# EAGLE design 7segement3digits1badidea-mk-1.0 (EAGLE 6.5.0)
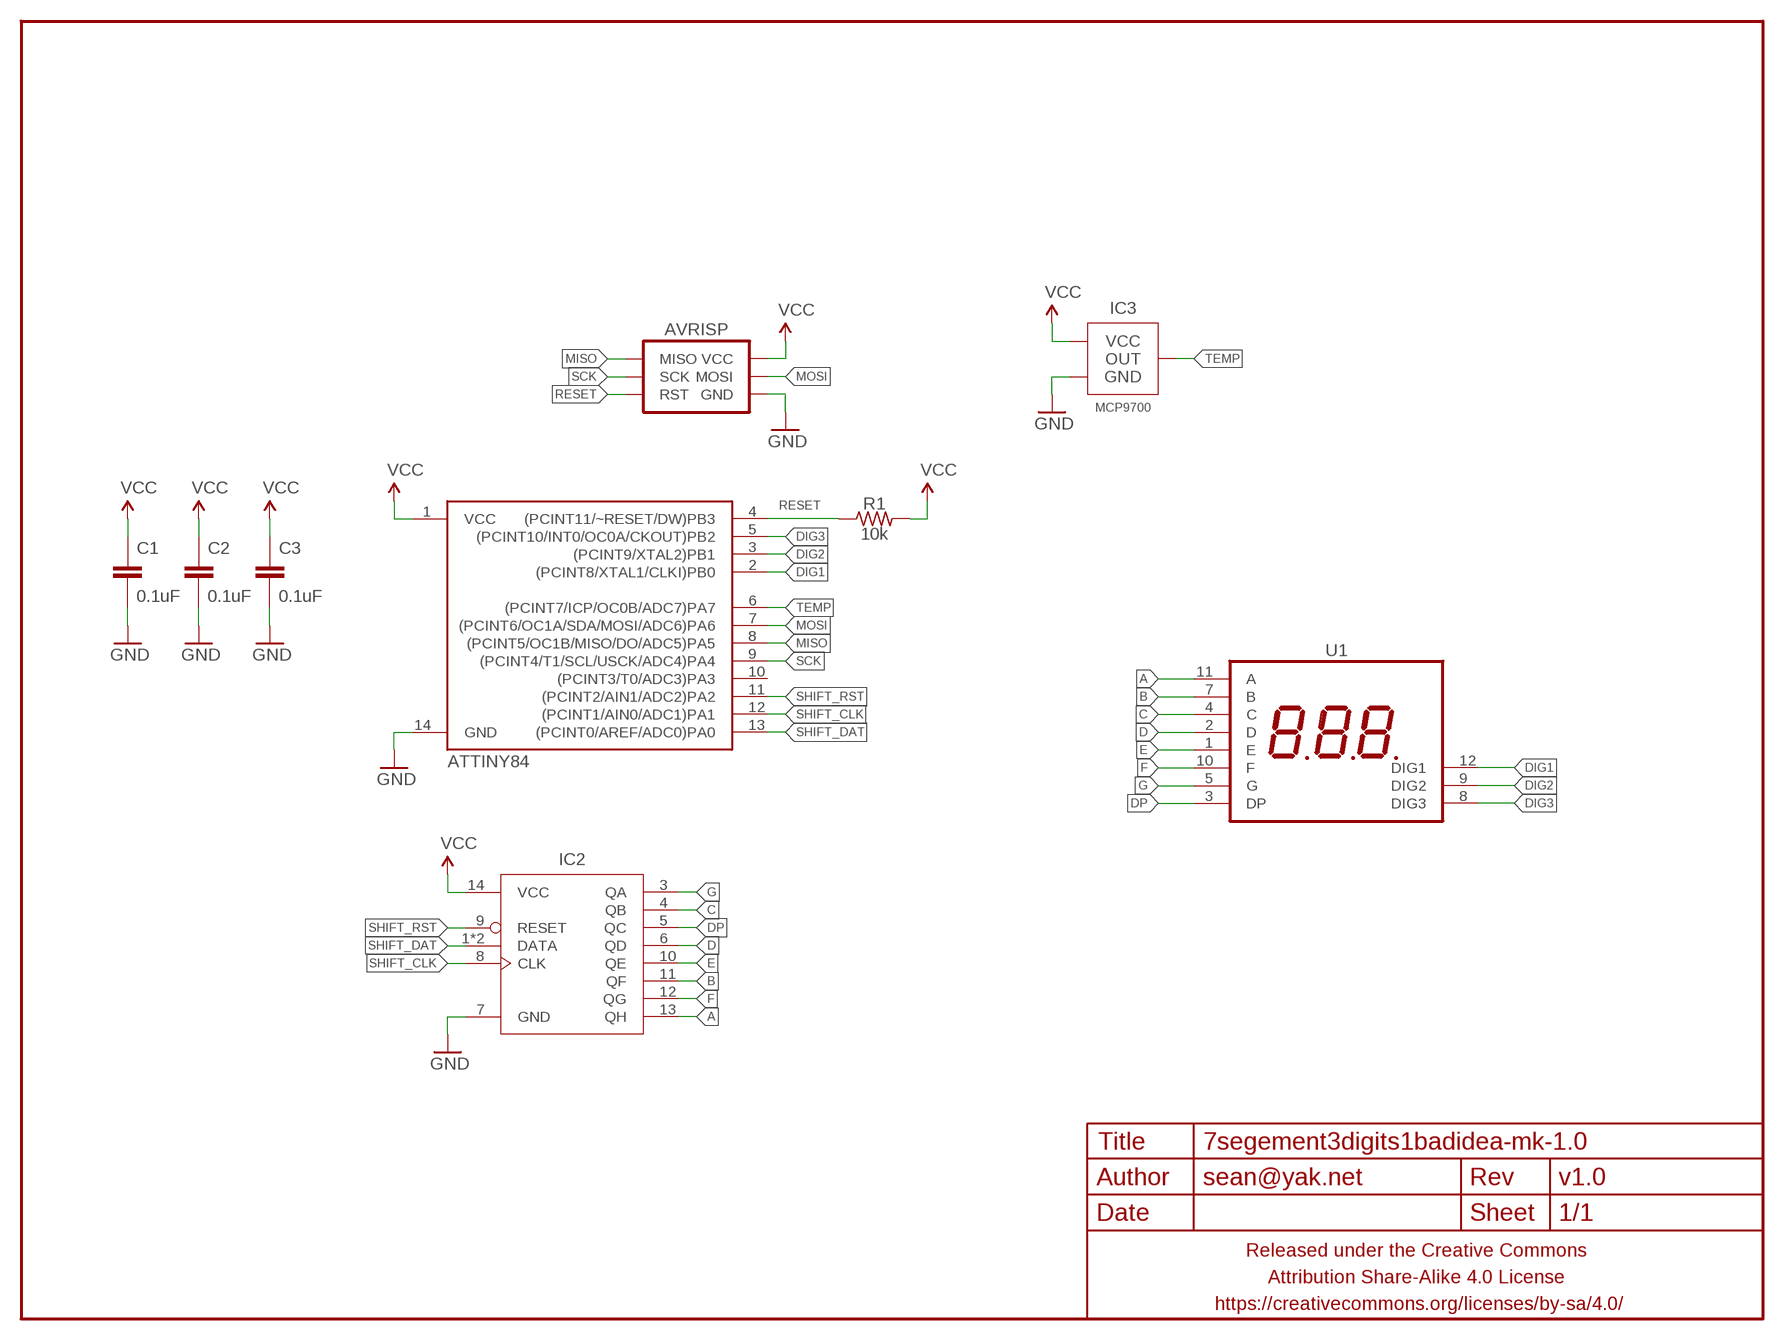
[diagram p0: schematic, sheet 1]

## Parts
AVRISP  AVR_SPI_PRG_6PTH_INLINE_I2C  [AVR_ISP_INLINE_PTH_I2C]
C1  0.1uF  CAPACITOR-CERAMICC0603  [C0603]
C2  0.1uF  CAPACITOR-CERAMICC0603  [C0603]
C3  0.1uF  CAPACITOR-CERAMICC0603  [C0603]
FRAME1  FRAME-LETTERNO_PACKAGE  [DUMMY]
IC1  ATTINY84  [SO14]
IC2  74HC164  74164SOIC  [SO14]
IC3  MCP9700  MCP9700SOT23  [SOT23]
R1  10k  RESISTORR0603  [R0603]
U1  7SEG_3DIGIT  [7SEG_3DIG_0.56IN]

## Nets
A: IC2.13(QH) U1.11(A)
B: IC2.11(QF) U1.7(B)
C: IC2.4(QB) U1.4(C)
D: IC2.6(QD) U1.2(D)
DIG1: IC1.2((PCINT8/XTAL1/CLKI)PB0) U1.12(DIG1)
DIG2: IC1.3((PCINT9/XTAL2)PB1) U1.9(DIG2)
DIG3: IC1.5((PCINT10/INT0/OC0A/CKOUT)PB2) U1.8(DIG3)
DP: IC2.5(QC) U1.3(DP)
E: IC2.10(QE) U1.1(E)
F: IC2.12(QG) U1.10(F)
G: IC2.3(QA) U1.5(G)
GND: AVRISP.GND C1.2 C2.2 C3.2 IC1.14(GND) IC2.7(GND) IC3.3(GND)
MISO: AVRISP.MISO IC1.8((PCINT5/OC1B/MISO/DO/ADC5)PA5)
MOSI: AVRISP.MOSI IC1.7((PCINT6/OC1A/SDA/MOSI/ADC6)PA6)
RESET: AVRISP.RESET(RST) IC1.4((PCINT11/~RESET/DW)PB3) R1.1
SCK: AVRISP.SCK IC1.9((PCINT4/T1/SCL/USCK/ADC4)PA4)
SHIFT_CLK: IC1.12((PCINT1/AIN0/ADC1)PA1) IC2.8(CLK)
SHIFT_DAT: IC1.13((PCINT0/AREF/ADC0)PA0) IC2.1(DATA) IC2.2(DATA)
SHIFT_RST: IC1.11((PCINT2/AIN1/ADC2)PA2) IC2.9(RESET)
TEMP: IC1.6((PCINT7/ICP/OC0B/ADC7)PA7) IC3.2(OUT)
VCC: AVRISP.VCC C1.1 C2.1 C3.1 IC1.1(VCC) IC2.14(VCC) IC3.1(VCC) R1.2
Unconnected: IC1.10((PCINT3/T0/ADC3)PA3)

## Library data of the parts
AVRISP = A_butts:AVR_SPI_PRG_6: AVR ISP 6 Pin This is the reduced ISP connector for AVR programming. Common on Arduino. This footprint will take up less PCB space and can be used with a 10-pin to 6-pin adapter such as SKU: BOB-08508 **Special note about "TEST_POINT" package. The stop mask is on the top side, so if you want your programming test points to be on the bottom of your board, make sure to place this package on the bottom side of the board. This also ensure that the orientation to program from the bottom side will be correct.
C1-C3 = A_butts:CAPACITOR-CERAMIC: CAPACITOR, European symbol
FRAME1 = A_butts:FRAME-LETTER: Schematic Frame Standard 8.5x11 US Letter frame; DESIGNER: sean@yak.net; VERSION: v1.0
IC1 = A_butts:ATTINY84: Atmel 14-pin 2/4/8kB flash uC
IC2 = a_parts:74*164
IC3 = a_parts:MCP9700
R1 = A_butts:RESISTOR: RESISTOR, American symbol
U1 = a_parts:7SEG_3DIGIT

## Board
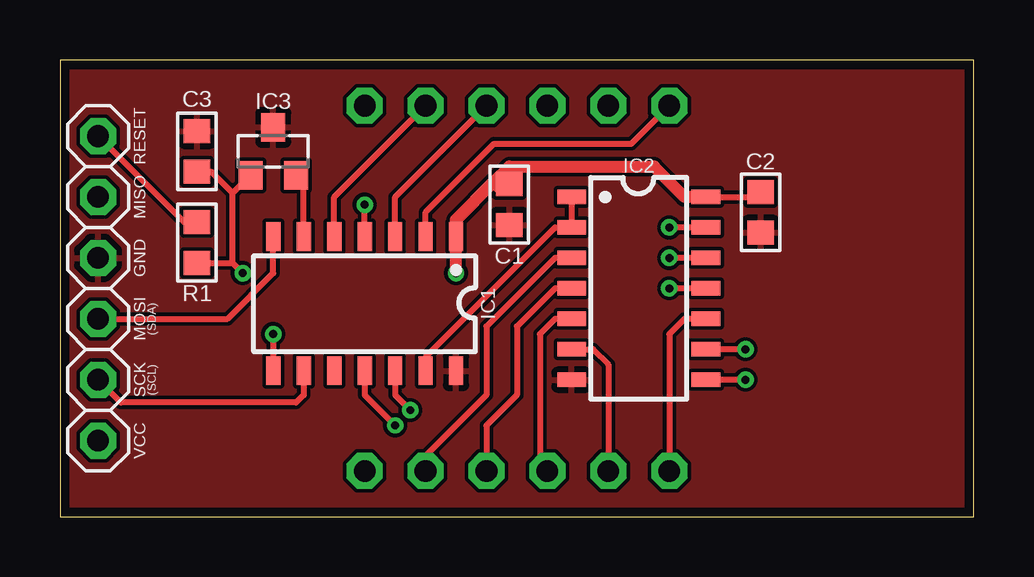
[diagram p1: board, top side]
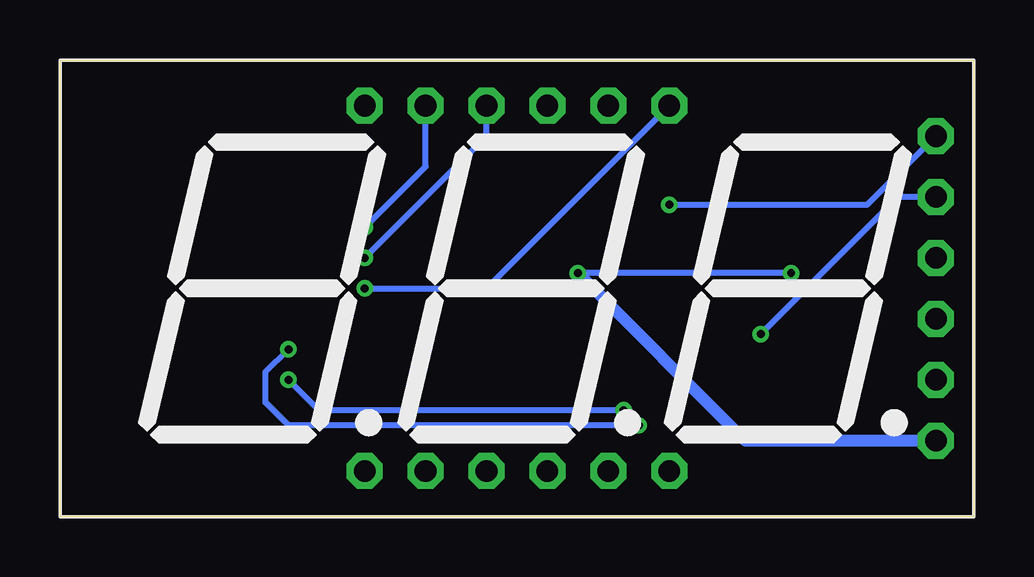
[diagram p2: board, bottom side, seen from below]

Size 38.1 x 19.05 mm. Coordinates in mm from the lower left corner, seen from the top.
Outline: 0,19.05 0,0 38.1,0 38.1,19.05 0,19.05
Copper layers (1*16): Top 0.0356mm / dielectric 1.5011mm / Bottom 0.0356mm
Design rules "LaenPCBOrder_2": minimum track width 6mil, minimum drill 13mil, track to track 6mil, track to pad 6mil, pad to pad 6mil, via to via 6mil, smd to smd 6mil, copper to edge 15mil, drill to drill 6mil, minimum pad ring 7mil, minimum via ring 7mil, stop-mask expansion 3mil, vias tented up to drill 20mil, thermal gap 10mil

### Footprints (pad centres in the part's own frame; a part is rotated, then mirrored left to right if it is on the bottom)
AVR_ISP_INLINE_PTH_I2C = drill 0.9 pad 1.5 octagon: GND 1.27,0; MISO 3.81,0; MOSI -1.27,0; RESET 6.35,0; SCK -3.81,0; VCC -6.35,0
C0603 = smd 1 x 1.1: 1 -0.85,0; 2 0.85,0
SO14 = smd 0.6 x 1.2: 1 -3.81,-2.8; 2 -2.54,-2.8; 3 -1.27,-2.8; 4 0,-2.8; 5 1.27,-2.8; 6 2.54,-2.8; 7 3.81,-2.8; 8 3.81,2.8; 9 2.54,2.8; 10 1.27,2.8; 11 0,2.8; 12 -1.27,2.8; 13 -2.54,2.8; 14 -3.81,2.8
SOT23 = smd 1 x 1.2: 1 -0.95,-1; 2 0.95,-1; 3 0,1
R0603 = smd 1 x 1.1: 1 -0.85,0; 2 0.85,0
7SEG_3DIG_0.56IN = drill 0.9 pad 1.5 octagon: 1 -6.35,-7.62; 2 -3.81,-7.62; 3 -1.27,-7.62; 4 1.27,-7.62; 5 3.81,-7.62; 6 6.35,-7.62; 7 6.35,7.62; 8 3.81,7.62; 9 1.27,7.62; 10 -1.27,7.62; 11 -3.81,7.62; 12 -6.35,7.62

### Placement (x,y rotation side)
AVRISP  1.59,9.53 90 top
C1  18.73,13.02 270 top
C2  29.21,12.7 270 top
C3  5.71,15.24 90 top
FRAME1  0,-0.5 0 top
IC1  12.7,8.89 180 top
IC2  24.13,9.53 270 top
IC3  8.89,15.24 0 top
R1  5.71,11.43 270 top
U1  19.05,9.53 0 bottom

### Tracks (layer width: path | path; a pad name or v marks a point on that pad's centre or on a via)
A  (via drill 0.33)
  Top 0.254: IC2.13 v25.4,12.06
  Bottom 0.254: v25.4,12.06 22.86,14.61 U1.11
B  (via drill 0.33)
  Top 0.254: IC2.11 v25.4,9.53
  Bottom 0.254: v25.4,9.53 20.32,9.53 U1.7
C
  Top 0.254: IC2.4 20.64,9.53 19.05,7.94 19.05,5.08 17.78,3.81 U1.4
D
  Top 0.254: IC2.6 22.23,6.99 22.86,6.35 U1.2
DIG1
  Top 0.254: IC1.2 15.24,12.7 18.1,15.56 23.81,15.56 U1.12
DIG2
  Top 0.254: IC1.3 13.97,13.34 U1.9
DIG3
  Top 0.254: IC1.5 11.43,13.34 U1.8
DP
  Top 0.254: IC2.5 20.64,8.26 20,7.62 20,2.22 U1.3
E
  Top 0.254: IC2.10 26.04,8.26 25.4,7.62 U1.1
F  (via drill 0.33)
  Top 0.254: IC2.12 v25.4,10.79
  Bottom 0.254: v25.4,10.79 20.32,15.88 U1.10
G
  Top 0.254: IC2.3 20.64,10.79 17.78,7.94 17.78,5.08 15.24,2.54 U1.5
GND
  pour Top: 0,0 0,19.05 38.1,19.05 38.1,0
MISO  (via drill 0.33)
  Top 0.254: v8.89,7.62 IC1.8
  Bottom 0.254: AVRISP.MISO 3.17,13.34 v8.89,7.62
MOSI
  Top 0.254: AVRISP.MOSI 6.99,8.26 8.89,10.16 IC1.7
RESET  (via drill 0.33)
  Top 0.254: AVRISP.RESET 5.18,12.28 R1.1 | IC1.4 v12.7,13.02
  Bottom 0.254: v12.7,13.02 4.45,13.02 AVRISP.RESET
SCK
  Top 0.254: IC1.9 10.16,5.08 9.84,4.76 2.54,4.76 AVRISP.SCK
SHIFT_CLK  (via drill 0.33)
  Top 0.254: IC1.12 13.97,5.08 v14.61,4.45 | v28.57,5.71 IC2.8
  Bottom 0.254: v14.61,4.45 27.3,4.45 v28.57,5.71
SHIFT_DAT
  Top 0.254: IC2.1 IC2.2 20.64,12.06 15.24,6.67 IC1.13
SHIFT_RST  (via drill 0.33)
  Top 0.254: IC1.11 12.7,5.08 v13.97,3.81 | v28.57,6.99 IC2.9
  Bottom 0.254: v13.97,3.81 28.57,3.81 29.53,4.76 29.53,6.03 v28.57,6.99
TEMP
  Top 0.254: IC1.6 10.16,13.92 IC3.2
VCC  (via drill 0.33)
  Top 0.254: R1.2 7.2,10.58 | 7.2,10.58 v7.62,10.16 | 7.2,10.58 7.2,13.5 | 7.2,13.5 IC3.1 | C3.1 6.31,14.39 7.2,13.5 | IC2.14 29,13.34 C2.1
  Top 0.508: v16.51,10.16 IC1.1 16.51,12.38 18.1,13.97 | IC2.14 26.04,13.34 24.77,14.61 18.73,14.61 18.1,13.97 | C1.1 18.41,13.65 18.1,13.97
  Bottom 0.254: v7.62,10.16 v16.51,10.16
  Bottom 0.508: AVRISP.VCC 9.53,3.17 v16.51,10.16